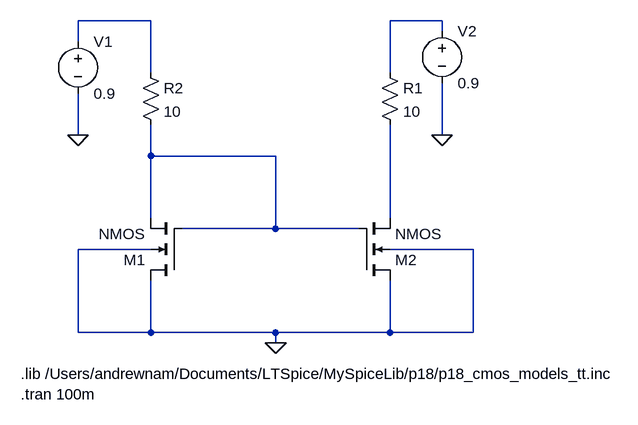
[diagram p0: schematic fig07_current_mirror.asc]
fig07_current_mirror.asc, the LTspice schematic file:
Version 4
SHEET 1 964 680
WIRE 224 -16 112 -16
WIRE 672 -16 592 -16
WIRE 672 0 672 -16
WIRE 112 16 112 -16
WIRE 224 64 224 -16
WIRE 592 64 592 -16
WIRE 112 160 112 96
WIRE 672 160 672 80
WIRE 224 192 224 144
WIRE 416 192 224 192
WIRE 224 288 224 192
WIRE 592 288 592 144
WIRE 416 304 416 192
WIRE 416 304 272 304
WIRE 544 304 416 304
WIRE 224 336 112 336
WIRE 720 336 592 336
WIRE 112 464 112 336
WIRE 224 464 224 384
WIRE 224 464 112 464
WIRE 416 464 224 464
WIRE 592 464 592 384
WIRE 592 464 416 464
WIRE 720 464 720 336
WIRE 720 464 592 464
WIRE 416 480 416 464
FLAG 416 480 0
FLAG 112 160 0
FLAG 672 160 0
SYMBOL nmos4 272 384 R180
SYMATTR InstName M1
SYMATTR Value2 l=0.18u w=10u
SYMBOL nmos4 544 384 M180
SYMATTR InstName M2
SYMATTR Value2 l=0.18u w=10u
SYMBOL voltage 112 0 R0
SYMATTR InstName V1
SYMATTR Value 0.9
SYMBOL voltage 672 -16 R0
SYMATTR InstName V2
SYMATTR Value 0.9
SYMBOL res 576 48 R0
SYMATTR InstName R1
SYMATTR Value 10
SYMBOL res 208 48 R0
SYMATTR InstName R2
SYMATTR Value 10
TEXT 24 528 Left 2 !.lib /Users/andrewnam/Documents/LTSpice/MySpiceLib/p18/p18_cmos_models_tt.inc\n.tran 100m

The netlist it stands for:
* fig07_current_mirror.asc
M1 0 N003 N003 0 NMOS l=0.18u w=10u
M2 0 N003 N004 0 NMOS l=0.18u w=10u
V1 N001 0 0.9
V2 N002 0 0.9
R1 N002 N004 10
R2 N001 N003 10
.model NMOS NMOS
.model PMOS PMOS
.lib standard.mos
.lib /Users/andrewnam/Documents/LTSpice/MySpiceLib/p18/p18_cmos_models_tt.inc
.tran 100m
.backanno
.end